# EAGLE design IOB-Inputs (EAGLE 7.7.0)
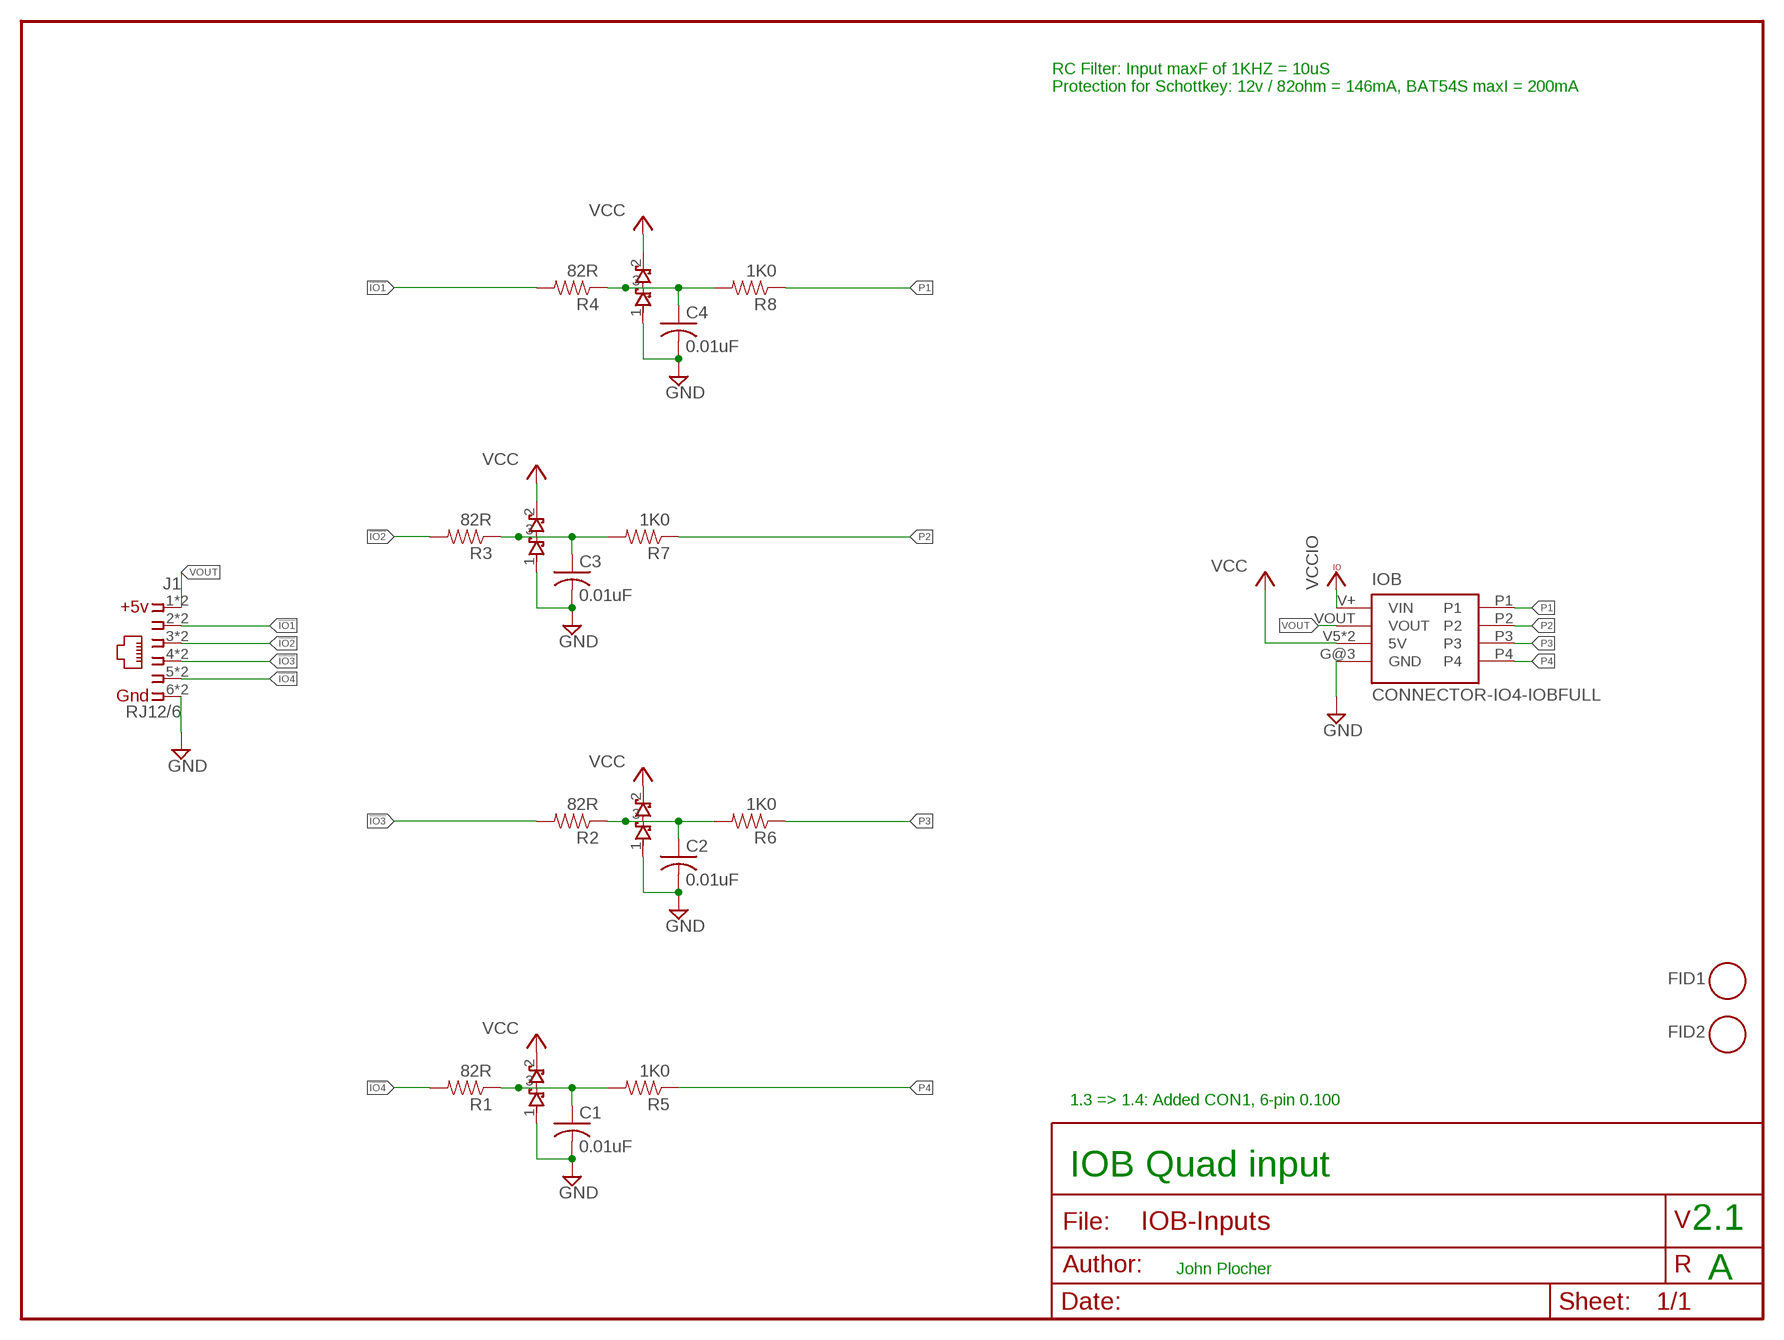
[diagram p0: schematic, sheet 1]

## Parts
C1  0.01uF  CAP0603  [0603-CAP]
C2  0.01uF  CAP0603  [0603-CAP]
C3  0.01uF  CAP0603  [0603-CAP]
C4  0.01uF  CAP0603  [0603-CAP]
D1  BAT54S  DIODE-BAT54S23  [SOT23]
D2  BAT54S  DIODE-BAT54S23  [SOT23]
D3  BAT54S  DIODE-BAT54S23  [SOT23]
D4  BAT54S  DIODE-BAT54S23  [SOT23]
FID1  FIDUCIAL  [FIDUCIAL_1MM]
FID2  FIDUCIAL  [FIDUCIAL_1MM]
IOB  CONNECTOR-IO4-IOBFULL  [IO4-IOB]
J1  RJ12/6  CONNECTOR-IO4IPINS  [RJ24-INVERTED-PINS]
R1  82R  R0805-RES  [0805-RES]
R2  82R  R0805-RES  [0805-RES]
R3  82R  R0805-RES  [0805-RES]
R4  82R  R0805-RES  [0805-RES]
R5  1K0  R0603-RES  [0603-RES]
R6  1K0  R0603-RES  [0603-RES]
R7  1K0  R0603-RES  [0603-RES]
R8  1K0  R0603-RES  [0603-RES]

## Nets
!IO1 [signals]: J1.2 J1.2@1 R4.2
!IO2 [signals]: J1.3 J1.3@1 R3.2
!IO3 [signals]: J1.4 J1.4@1 R2.2
!IO4 [signals]: J1.5 J1.5@1 R1.2
GND [Power]: C1.2 C2.2 C3.2 C4.2 D1.1(A1) D2.1(A1) D3.1(A1) D4.1(A1) IOB.G@3(GND) J1.6 J1.6@1
N$10: C1.1 D1.3(COM) R1.1 R5.2
N$12: C2.1 D2.3(COM) R2.1 R6.2
N$13: C3.1 D3.3(COM) R3.1 R7.2
N$14: C4.1 D4.3(COM) R4.1 R8.2
P1 [signals]: IOB.P1 R8.1
P2 [signals]: IOB.P2 R7.1
P3 [signals]: IOB.P3 R6.1
P4 [signals]: IOB.P4 R5.1
VCC [Power]: D1.2(C2) D2.2(C2) D3.2(C2) D4.2(C2) IOB.V5(5V) IOB.V5@1(5V)
VCCIO: IOB.V+(VIN)
VOUT [Power]: IOB.VOUT J1.1 J1.1@1

## Notes on the sheet
- RC Filter: Input maxF of 1KHZ = 10uS
  Protection for Schottkey: 12v / 82ohm = 146mA, BAT54S maxI = 200mA
- 1.3 => 1.4: Added CON1, 6-pin 0.100
- IOB Quad input
- 2.1
- John Plocher
- A

## Library data of the parts
C1-C4 = SPCoast:CAP*
D1-D4 = SPCoast:DIODE-BAT54S
FID1 FID2 = SPCoast:FIDUCIAL: For use by pick and place machines to calibrate the vision/machine, 1mm By microbuilder.eu
IOB = SPCoast:CONNECTOR-IO4-IOB
J1 = SPCoast:CONNECTOR-IO4
R1-R8 = SPCoast:R*: Resistor Basic schematic elements and footprints for 0603, 1206, and PTH 1/10th watt (small) resistors.

## Net classes
0 default: width 0.254 mm, drill 0.4 mm, clearance 0.127 mm
1 Power: width 0.254 mm, drill 0.4 mm, clearance 0.127 mm
2 signals: width 0.254 mm, drill 0.4 mm, clearance 0.127 mm

## Board
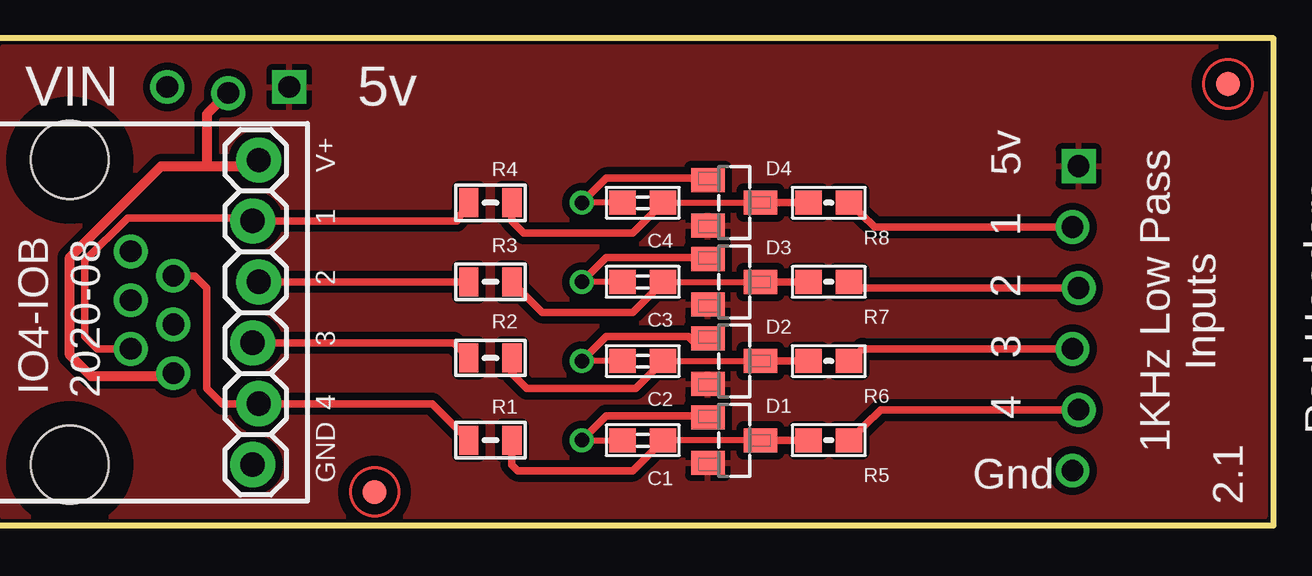
[diagram p1: board, top side]
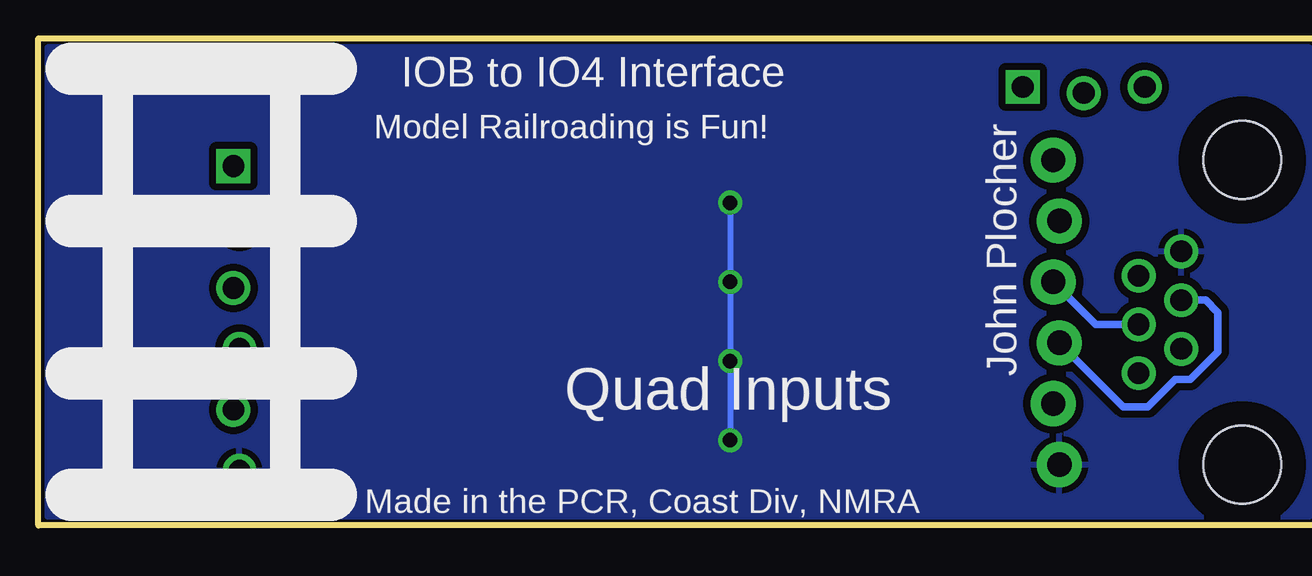
[diagram p2: board, bottom side, seen from below]

No outline drawn. Coordinates in mm, seen from the top.
Copper layers (1*16): Top 0.035mm / dielectric 1.5mm / Bottom 0.035mm
Design rules "default *": minimum track width 10mil, minimum drill 0.4mm, track to track 6mil, track to pad 8mil, pad to pad 8mil, via to via 8mil, smd to smd 8mil, copper to edge 40mil, drill to drill 8mil, minimum pad ring 10mil, minimum via ring 8mil, stop-mask expansion 4mil, vias tented up to drill 0mil, thermal gap 10mil
Milling: 4 lines

### Footprints (pad centres in the part's own frame; a part is rotated, then mirrored left to right if it is on the bottom)
0603-CAP = smd 1.1 x 1: 1 -0.85,0; 2 0.85,0
SOT23 = smd 1.4 x 1: 1 1.1,-0.95; 2 1.1,0.95; 3 -1.1,0
FIDUCIAL_1MM = smd 1 x 1: 1 0,0
IO4-IOB = drill 0.9: G@3 44.958,2.286; P1 44.958,12.446; P2 45.212,9.906; P3 44.958,7.366; P4 45.212,4.826; V+ 7.239,18.288; VOUT 9.779,18.034 | drill 0.9 square: V5 12.319,18.288; V5@1 45.212,14.986
RJ24-INVERTED-PINS = drill 1.016 pad 1.88: 1 6.35,-4.064; 2 3.81,-3.81; 3 1.27,-4.064; 4 -1.27,-3.81; 5 -3.81,-4.064; 6 -6.35,-3.81 | drill 0.9 pad 1.4: 1@1 -2.54,-0.508; 2@1 -1.524,1.27; 3@1 -0.508,-0.508; 4@1 0.508,1.27; 5@1 1.524,-0.508; 6@1 2.54,1.27 | hole 3.251: 6.35,3.81; -6.35,3.81
0805-RES = smd 0.8 x 1.2: 1 -0.9,0; 2 0.9,0
0603-RES = smd 1.1 x 1: 1 -0.85,0; 2 0.85,0

### Placement (x,y rotation side)
C1  27.05,3.56 180 top
C2  27.05,6.86 180 top
C3  27.05,10.16 180 top
C4  27.05,13.46 180 top
D1  30.86,3.56 180 top
D2  30.86,6.86 180 top
D3  30.86,10.16 180 top
D4  30.86,13.46 180 top
FID1  15.88,1.4 0 top
FID2  51.44,18.41 0 top
IOB  0,0 0 top
J1  6.99,8.89 90 top
R1  20.7,3.56 180 top
R2  20.7,6.99 180 top
R3  20.7,10.16 180 top
R4  20.7,13.46 180 top
R5  34.8,3.56 180 top
R6  34.8,6.86 180 top
R7  34.8,10.16 180 top
R8  34.8,13.46 180 top

### Tracks (layer width: path | path; a pad name or v marks a point on that pad's centre or on a via)
!IO1
  Top 0.305: J1.2@1 4.32,7.37 3.81,7.87 3.81,11.05 5.59,12.83 10.67,12.83 J1.2 19.29,12.7 R4.2
!IO2
  Top 0.305: R3.2 J1.3
  Bottom 0.305: J1.3@1 9.27,8.38 J1.3
!IO3
  Top 0.305: R2.2 19.17,7.62 J1.4
  Bottom 0.305: J1.4@1 4.7,9.4 4.19,8.89 4.19,7.24 5.33,6.1 5.97,6.1 7.11,4.95 8.13,4.95 J1.4
!IO4
  Top 0.305: J1.5@1 8.38,10.41 8.89,9.91 8.89,5.71 9.53,5.08 J1.5 18.28,5.08 R1.2
GND  (via drill 0.6)
  Top 0.254: C4.2 v24.51,13.46 | v24.51,3.56 C1.2 | C2.2 v24.51,6.86 | C3.2 v24.51,10.16
  Top 0.305: D1.1 29.45,4.21 29.08,4.57 25.53,4.57 v24.51,3.56 | D2.1 29.32,7.51 28.96,7.87 25.53,7.87 v24.51,6.86 | D3.1 29.45,10.81 29.08,11.18 25.53,11.18 v24.51,10.16 | D4.1 29.45,14.11 29.08,14.48 25.53,14.48 v24.51,13.46
  Bottom 0.254: v24.51,13.46 v24.51,10.16 v24.51,6.86 v24.51,3.56
  pour Bottom (isolate 0.305): 0.38,0.38 0.38,19.94 52.96,19.94 52.96,0.38
N$10
  Top 0.254: D1.3 C1.1
  Top 0.305: D1.3 R5.2 | R1.1 21.59,2.54 21.84,2.29 26.63,2.29 C1.1
N$12
  Top 0.254: C2.1 D2.3
  Top 0.305: D2.3 R6.2 | R2.1 21.59,6.35 22.23,5.71 26.76,5.71 C2.1
N$13
  Top 0.254: C3.1 D3.3
  Top 0.305: D3.3 R7.2 | R3.1 22.23,9.53 22.86,8.89 26.63,8.89 C3.1
N$14
  Top 0.254: C4.1 D4.3
  Top 0.305: D4.3 R8.2 | R4.1 21.59,12.7 22.1,12.19 26.63,12.19 C4.1
P1
  Top 0.305: R8.1 36.71,12.45 IOB.P1
P2
  Top 0.305: R7.1 35.95,9.91 IOB.P2
P3
  Top 0.305: R6.1 36.21,7.37 IOB.P3
P4
  Top 0.305: R5.1 36.97,4.83 IOB.P4
VCC
  pour Top (isolate 0.305): 0.38,0.38 0.38,19.94 52.96,19.94 52.96,0.38
VOUT
  Top 0.305: 10.79,14.99 J1.1
  Top 0.406: J1.1@1 6.99,6.35 6.86,6.22 4.06,6.22 3.17,7.11 3.17,11.18 6.99,14.99 8.89,14.99 | 8.89,14.99 10.79,14.99 | IOB.VOUT 8.89,17.14 8.89,14.99

### Text on the board
tPlace: Inputs | IO4-IOB | 2020-08 | Red Headers | Red Soldermask / White Silkscreen | 1KHz Low Pass | 2.1
bPlace: John Plocher | Quad Inputs
_tNames: R4 | D4 | R3 | C4 | D3 | R8 | R2 | C3 | D2 | R7 | C2 | R6 | R1 | D1 | C1 | R5